# Altium schematic sheet Necklace_schematic.SchDoc: Omamori Schematic
size A4; Author: Felix Mark; DrawnBy: Felix Mark; DocumentNumber: 1; Revision: 1.0; SheetNumber: 1; SheetTotal: 1
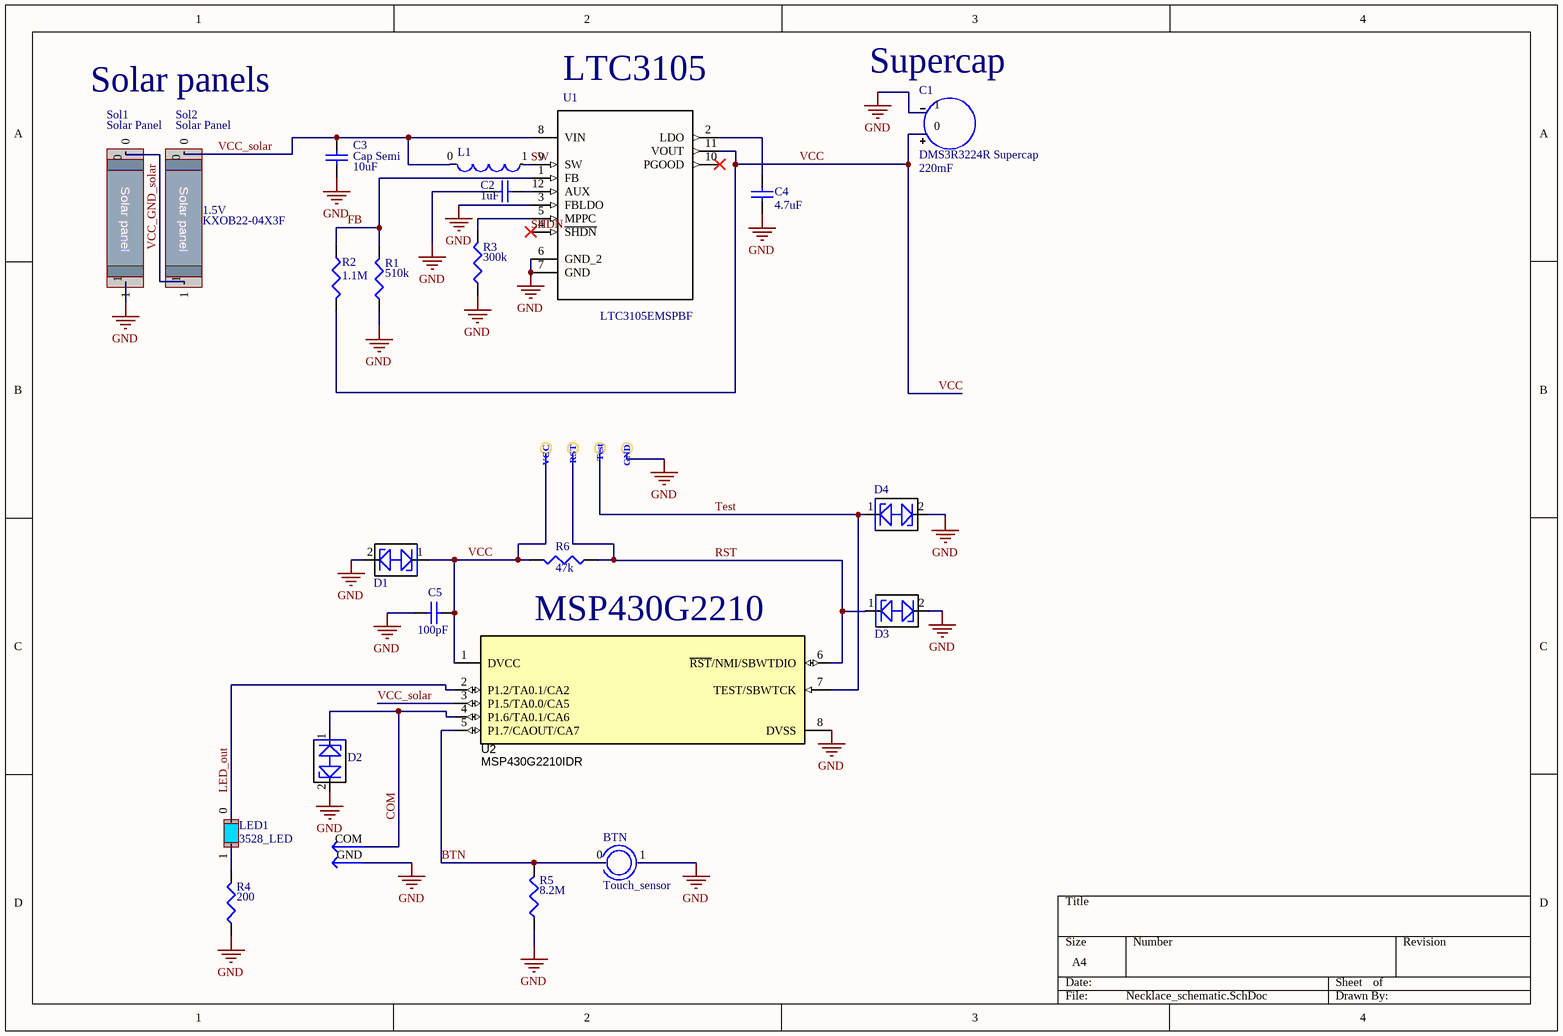
[diagram p0: Necklace_schematic.SchDoc]

## Parts
BTN  Touch_sensor  [Touch_sensor]
C1  DMS3R3224R Supercap  Capacity: 220mF  [DMS3R3224R Supercap]
C2  value 1uF  [C0805]  (hidden comment: Cap Semi)
C3  Cap Semi  value 10uF  [C0805]
C4  value 4.7uF  [C0805]  (hidden comment: Cap Semi)
C5  value 100pF  [C0805]  (hidden comment: Cap Semi)
COM  COM  [Synchronizer]  (value not drawn)
D1  ESD-Diode  [Schutzdiode]  (value not drawn)
D2  ESD-Diode  [Schutzdiode]  (value not drawn)
D3  ESD-Diode  [Schutzdiode]  (value not drawn)
D4  ESD-Diode  [Schutzdiode]  (value not drawn)
L1  Inductor  [Inductivity]  (value not drawn)
LED1  3528_LED  [3528_LED]
R1  value 510k  [6-0805_N]  (hidden comment: Res3)
R2  value 1.1M  [6-0805_N]  (hidden comment: Res3)
R3  value 300k  [6-0805_N]  (hidden comment: Res3)
R4  value 200  [6-0805_N]  (hidden comment: Res3)
R5  value 8.2M  [6-0805_N]  (hidden comment: Res3)
R6  value 47k  [6-0805_N]  (hidden comment: Res3)
Sol1  Solar Panel  [Solarzelle]
Sol2  Solar Panel  Vmpp: 1.5V  Name: KXOB22-04X3F  [Solarzelle]
U1  LTC3105EMSPBF  [SOP65P490X110-12N]
U2  MSP430G2210IDR  [MSP430G2210]
U3  Program_connector  [Program_connector]  (value not drawn)

## Nets
GND: BTN.1 C1.1 C2.1 C3.1 C4.2 C5.1 COM.GND D1.2 D2.2 D3.2 D4.2 R1.1 R3.1 R4.1 R5.1 Sol1.1 U1.3(FBLDO) U1.6(GND_2) U1.7(GND) U2.8(DVSS) U3.3(GND)
BTN: BTN.0 R5.2 U2.5(P1.7/CAOUT/CA7)
COM: COM.COM(Synchronize) D2.1 U2.4(P1.6/TA0.1/CA6)
FB: R1.2 R2.1 U1.1(FB)
LED_out: LED1.0 U2.2(P1.2/TA0.1/CA2)
RST: D3.1 R6.1 U2.6(~{RST}/NMI/SBWTDIO) U3.1(RST)
SHDN: U1.4(~{SHDN})
SW: L1.1 U1.9(SW)
Test: D4.1 U2.7(TEST/SBWTCK) U3.2(Test)
VCC: C1.0 C5.2 D1.1 R2.2 R6.2 U1.11(VOUT) U2.1(DVCC) U3.0(VCC)
VCC_GND_solar: Sol1.0 Sol2.1
VCC_solar: C3.2 L1.0 Sol2.0 U1.8(VIN) U2.3(P1.5/TA0.0/CA5)
NetC2_2: C2.2 U1.12(AUX)
NetC4_1: C4.1 U1.2(LDO)
NetLED1_1: LED1.1 R4.2
NetR3_2: R3.2 U1.5(MPPC)

Not connected (* = marked no-connect by the designer): U1 10(PGOOD)*

## Notes on the sheet
- Solar panels
- (near U1) LTC3105
- (near C1) Supercap
- MSP430G2210
- (in symbol Solar_Panel) Solar panel

## Library data of the parts
C2-C5 = Cap Semi: Capacitor (Semiconductor SIM Model); Published: 8-Jun-2000; LatestRevisionDate: 29-May-2009; LatestRevisionNote: IPC-7351 Footprint Added.; PackageReference: C1206; Publisher: Altium Limited; PackageDescription: Chip Capacitor
L1 = Inductivity
R1-R6 = Res3: Resistor; Published: 8-Jun-2000; LatestRevisionDate: 29-May-2009; LatestRevisionNote: IPC-7351 Footprint Added.; PackageReference: J1-0603; Publisher: Altium Limited; PackageDescription: Chip Resistor
Sol1 Sol2 = Solar_Panel
U1 = LTC3105EMSPBF: Ic Conv Dc/Dc Step Down 12-Msop; MF: Linear Technology/Analog; MP: LTC3105EMS#PBF; Availability: Unavailable; Package: MSOP-12 Linear Technology; SnapEDA_Link: https://www.snapeda.com/parts/LTC3105EMS%23PBF/Linear%20Technology/Analog%20Devices/view-part/?ref=snap; Price: None; Value: *
U2 = MSP430G2210IDR: MIXED SIGNAL MICROCONTROLLER, D0008A; Manufacturer: Texas Instruments; SymbolCreator: Altium; CompType: IC; U/M: EA; SymbolVersion: 2015-05-26; PartNumber: MSP430G2210IDR; Alternate PartNumber: MSP430G2210ID; PackageReference: D0008A; MountType: SMT; ComponentLink1Description: Datasheet Link; ComponentLink1URL: http://www.ti.com/lit/ds/symlink/msp430g2210.pdf; RoHS: Y; Publisher: Texas Instruments; LatestRevisionDate: 2015-05-28; Alternate Manufacturer: Texas Instruments